# Altium project EAS_Driver.PrjPcb
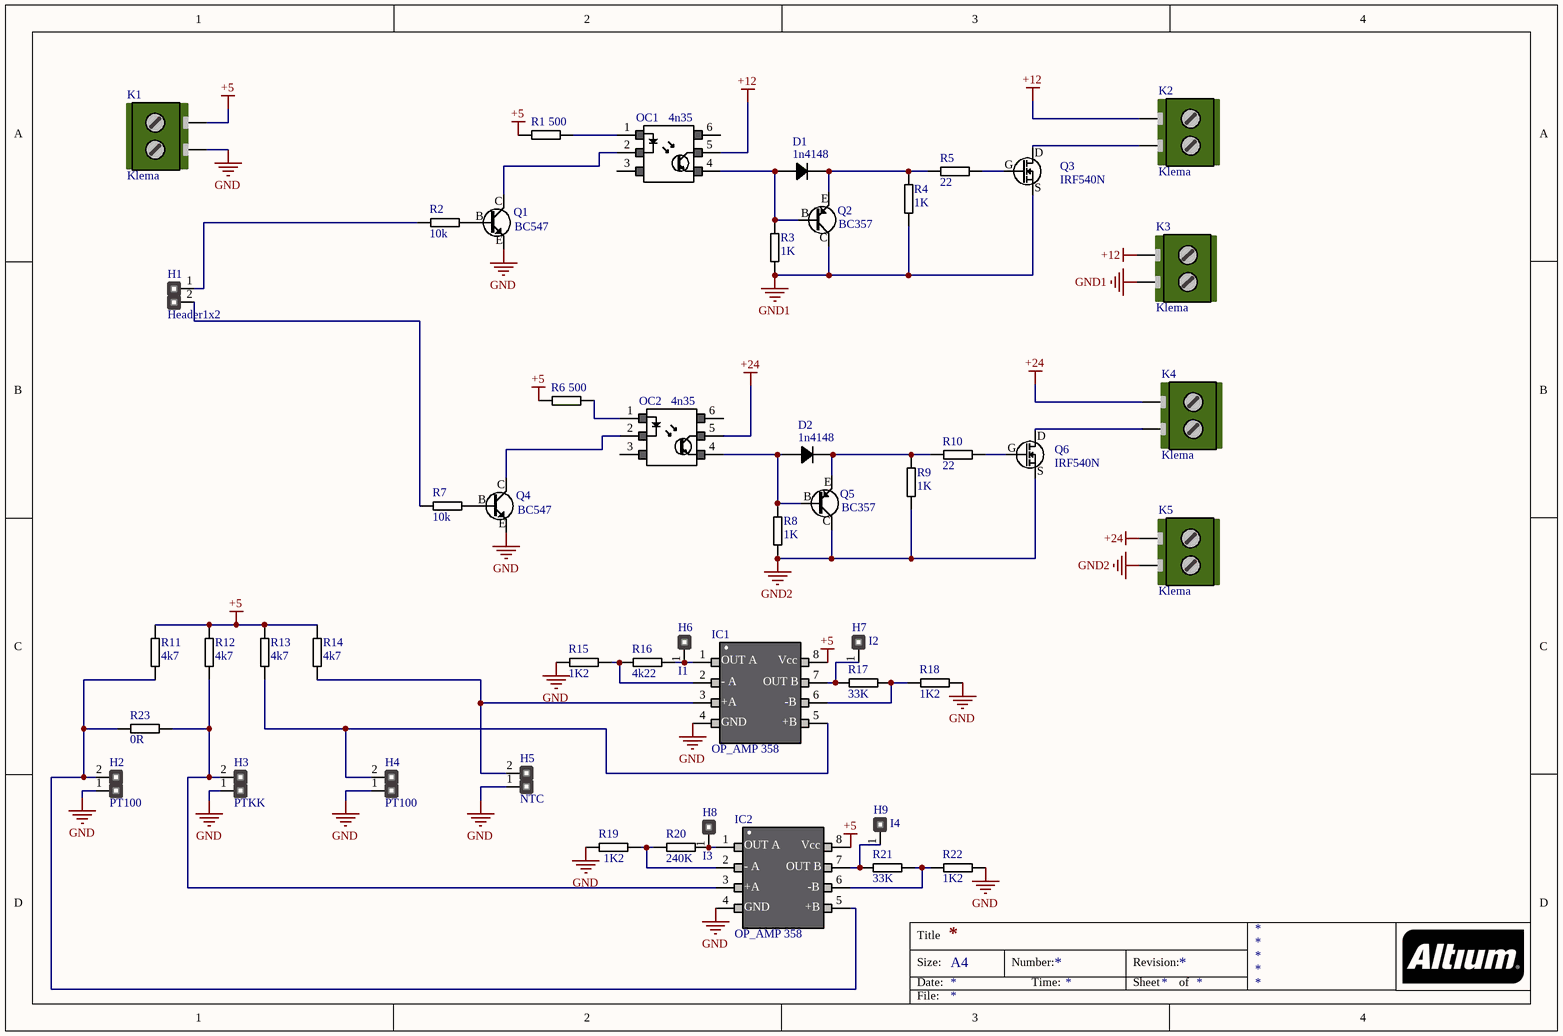
[diagram p0: Sema_Driver.SchDoc]
1 sheet, 49 parts. Net scope: global (net labels, ports and power ports of the same name join across sheets).
Board file: driver_PCB.PcbDoc

## Sheet Sema_Driver.SchDoc
size A4

### Parts
D1  1n4148  [D1(300milsa)]
D2  1n4148  [D1(300milsa)]
H1  Header1x2  [Header1x2]
H2  PT100  [Header1x2]
H3  PTKK  [Header1x2]
H4  PT100  [Header1x2]
H5  NTC  [Header1x2]
H6  I1  [H1x1]
H7  I2  [H1x1]
H8  I3  [H1x1]
H9  I4  [H1x1]
IC1  OP_AMP 358  [DIP8]
IC2  OP_AMP 358  [DIP8]
K1  Klema  [Klema]
K2  Klema  [Klema]
K3  Klema  [Klema]
K4  Klema  [Klema]
K5  Klema  [Klema]
OC1  4n35  [DIP6]
OC2  4n35  [DIP6]
Q1  BC547  [TO-92]
Q2  BC357  [TO-92]
Q3  IRF540N  [N-Channel MOSFET]
Q4  BC547  [TO-92]
Q5  BC357  [TO-92]
Q6  IRF540N  [N-Channel MOSFET]
R1  500  [R1(300milsa)]
R2  10k  [R1(300milsa)]
R3  1K  [R1(300milsa)]
R4  1K  [R1(300milsa)]
R5  22  [R1(300milsa)]
R6  500  [R1(300milsa)]
R7  10k  [R1(300milsa)]
R8  1K  [R1(300milsa)]
R9  1K  [R1(300milsa)]
R10  22  [R1(300milsa)]
R11  4k7  [R1(300milsa)]
R12  4k7  [R1(300milsa)]
R13  4k7  [R1(300milsa)]
R14  4k7  [R1(300milsa)]
R15  1K2  [R1(300milsa)]
R16  4k22  [R1(300milsa)]
R17  33K  [R1(300milsa)]
R18  1K2  [R1(300milsa)]
R19  1K2  [R1(300milsa)]
R20  240K  [R1(300milsa)]
R21  33K  [R1(300milsa)]
R22  1K2  [R1(300milsa)]
R23  0R  [R1(200milsa)]

### Nets
+5: IC1.8 IC2.8 K1.2 R1.2 R6.2 R11.2 R12.2 R13.2 R14.1
+12: K2.1 K3.1 OC1.5
+24: K4.1 K5.1 OC2.5
GND: H2.1 H3.1 H4.1 H5.1 IC1.4 IC2.4 K1.1 Q1.2 Q4.2 R15.1 R18.2 R19.1 R22.2
GND1: K3.2 Q2.3 Q3.3 R3.1 R4.1
GND2: K5.2 Q5.3 Q6.3 R8.1 R9.1
NetD1_1: D1.1 OC1.4 Q2.1 R3.2
NetD1_2: D1.2 Q2.2 R4.2 R5.1
NetD2_1: D2.1 OC2.4 Q5.1 R8.2
NetD2_2: D2.2 Q5.2 R9.2 R10.1
NetH1_1: H1.1 R2.1
NetH1_2: H1.2 R7.1
NetH2_2: H2.2 IC2.5 R11.1 R23.1
NetH3_2: H3.2 IC2.3 R12.1 R23.2
NetH4_2: H4.2 IC1.5 R13.1
NetH5_2: H5.2 IC1.3 R14.2
NetH6_1: H6.1 IC1.1 R16.2
NetH7_1: H7.1 IC1.7 R17.1
NetH8_1: H8.1 IC2.1 R20.2
NetH9_1: H9.1 IC2.7 R21.1
NetIC1_2: IC1.2 R15.2 R16.1
NetIC1_6: IC1.6 R17.2 R18.1
NetIC2_2: IC2.2 R19.2 R20.1
NetIC2_6: IC2.6 R21.2 R22.1
NetK2_2: K2.2 Q3.2
NetK4_2: K4.2 Q6.2
NetOC1_1: OC1.1 R1.1
NetOC1_2: OC1.2 Q1.3
NetOC2_1: OC2.1 R6.1
NetOC2_2: OC2.2 Q4.3
NetQ1_1: Q1.1 R2.2
NetQ3_1: Q3.1 R5.2
NetQ4_1: Q4.1 R7.2
NetQ6_1: Q6.1 R10.2

Not connected (* = marked no-connect by the designer): OC1 3 6; OC2 3 6

### Notes on the sheet
- Title
- Size:
- Date:
- A4
- Number:
- Time:
- Revision:
- Sheet
- of
- File:
- (in symbol N-Channel MOSFET) D; G; S
- (in symbol OP_AMP 358) OUT A; Vcc; - A; OUT B; +A; -B; GND; +B
- (in symbol Transistor NPN) C; B; E
- (in symbol Transistor PNP) E; B; C

### Library data of the parts
D1 D2 = D1
H2-H5 = Header1x2
H6-H9 = H1x1
OC1 OC2 = 4n35(optocapler)
Q1 Q4 = Transistor NPN
Q2 Q5 = Transistor PNP
Q3 Q6 = N-Channel MOSFET
R1-R23 = R1